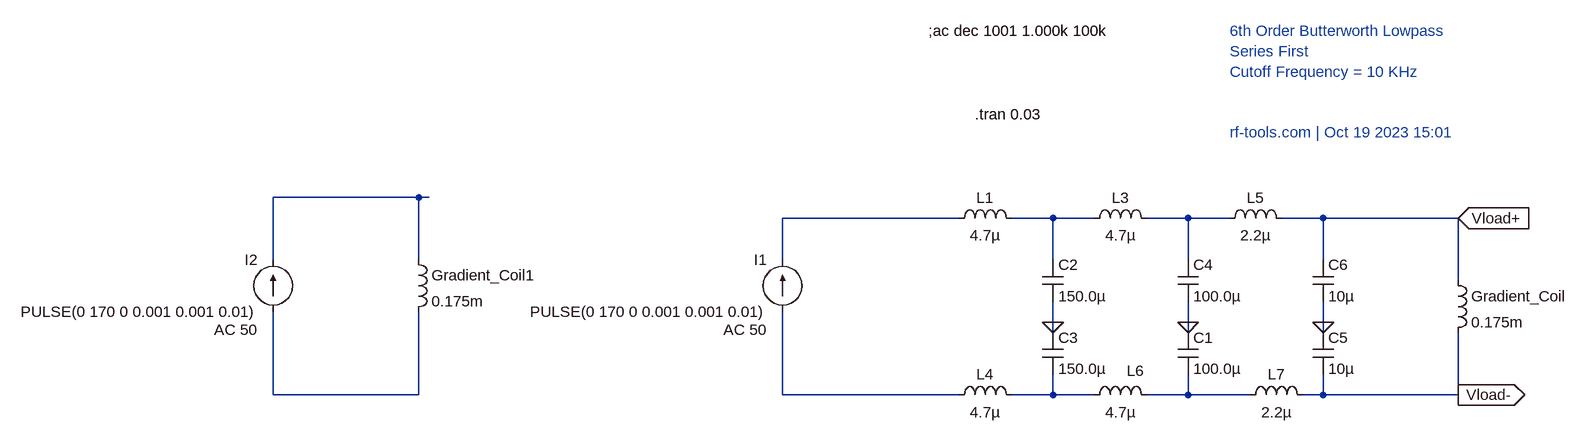
[diagram p0: schematic FinalV1.asc]
FinalV1.asc, the LTspice schematic file:
Version 4
SHEET 1 1200 400
WIRE -768 -32 -992 -32
WIRE -752 -32 -768 -32
WIRE 64 0 -208 0
WIRE 208 0 144 0
WIRE 272 0 208 0
WIRE 416 0 352 0
WIRE 480 0 416 0
WIRE 624 0 560 0
WIRE 832 0 624 0
WIRE -992 64 -992 -32
WIRE -768 64 -768 -32
WIRE -208 64 -208 0
WIRE 208 64 208 0
WIRE 416 64 416 0
WIRE 624 64 624 0
WIRE 832 96 832 0
WIRE 208 160 208 128
WIRE 416 160 416 128
WIRE 624 160 624 128
WIRE 208 176 208 160
WIRE 416 176 416 160
WIRE 624 176 624 160
WIRE -992 272 -992 144
WIRE -768 272 -768 144
WIRE -768 272 -992 272
WIRE -208 272 -208 144
WIRE 64 272 -208 272
WIRE 208 272 208 240
WIRE 208 272 144 272
WIRE 272 272 208 272
WIRE 416 272 416 240
WIRE 416 272 352 272
WIRE 512 272 416 272
WIRE 624 272 624 240
WIRE 624 272 592 272
WIRE 832 272 832 176
WIRE 832 272 624 272
FLAG 208 160 0
FLAG 416 160 0
FLAG 624 160 0
FLAG 832 0 Vload+
IOPIN 832 0 In
FLAG 832 272 Vload-
IOPIN 832 272 Out
SYMBOL ind 48 16 R270
WINDOW 0 32 56 VTop 2
WINDOW 3 5 56 VBottom 2
SYMATTR InstName L1
SYMATTR Value 4.7µ
SYMBOL cap 192 64 R0
SYMATTR InstName C2
SYMATTR Value 150.0µ
SYMBOL ind 256 16 R270
WINDOW 0 32 56 VTop 2
WINDOW 3 5 56 VBottom 2
SYMATTR InstName L3
SYMATTR Value 4.7µ
SYMBOL cap 400 64 R0
SYMATTR InstName C4
SYMATTR Value 100.0µ
SYMBOL ind 464 16 R270
WINDOW 0 32 56 VTop 2
WINDOW 3 5 56 VBottom 2
SYMATTR InstName L5
SYMATTR Value 2.2µ
SYMBOL cap 608 64 R0
SYMATTR InstName C6
SYMATTR Value 10µ
SYMBOL cap 400 176 R0
SYMATTR InstName C1
SYMATTR Value 100.0µ
SYMBOL cap 192 176 R0
SYMATTR InstName C3
SYMATTR Value 150.0µ
SYMBOL cap 608 176 R0
SYMATTR InstName C5
SYMATTR Value 10µ
SYMBOL ind 816 80 R0
SYMATTR InstName Gradient_Coil
SYMATTR Value 0.175m
SYMATTR SpiceLine Rser=0.194
SYMBOL ind 48 288 R270
WINDOW 0 32 56 VTop 2
WINDOW 3 5 56 VBottom 2
SYMATTR InstName L4
SYMATTR Value 4.7µ
SYMBOL ind 256 288 R270
WINDOW 0 38 79 VTop 2
WINDOW 3 5 56 VBottom 2
SYMATTR InstName L6
SYMATTR Value 4.7µ
SYMBOL ind 496 288 R270
WINDOW 0 32 56 VTop 2
WINDOW 3 5 56 VBottom 2
SYMATTR InstName L7
SYMATTR Value 2.2µ
SYMBOL current -208 144 R180
WINDOW 0 24 80 Left 2
WINDOW 3 24 0 Left 2
WINDOW 123 24 -28 Left 2
WINDOW 39 0 0 Left 0
SYMATTR InstName I1
SYMATTR Value PULSE(0 170 0 0.001 0.001 0.01)
SYMATTR Value2 AC 50
SYMBOL current -992 144 R180
WINDOW 0 24 80 Left 2
WINDOW 3 24 0 Left 2
WINDOW 123 24 -28 Left 2
WINDOW 39 0 0 Left 0
SYMATTR InstName I2
SYMATTR Value PULSE(0 170 0 0.001 0.001 0.01)
SYMATTR Value2 AC 50
SYMBOL ind -784 48 R0
SYMATTR InstName Gradient_Coil1
SYMATTR Value 0.175m
SYMATTR SpiceLine Rser=0.194
TEXT 16 -288 Left 2 !;ac dec 1001 1.000k 100k
TEXT 480 -288 Left 2 ;6th Order Butterworth Lowpass\nSeries First\nCutoff Frequency = 10 KHz\n\n\nrf-tools.com | Oct 19 2023 15:01
TEXT 88 -160 Left 2 !.tran 0.03

The netlist it stands for:
* FinalV1.asc
L1 N002 N003 4.7µ
C2 N003 0 150.0µ
L3 N003 N004 4.7µ
C4 N004 0 100.0µ
L5 N004 Vload+ 2.2µ
C6 Vload+ 0 10µ
C1 0 N008 100.0µ
C3 0 N007 150.0µ
C5 0 Vload- 10µ
L§Gradient_Coil Vload+ Vload- 0.175m Rser=0.194
L4 N006 N007 4.7µ
L6 N007 N008 4.7µ
L7 N008 Vload- 2.2µ
I1 N006 N002 PULSE(0 170 0 0.001 0.001 0.01) AC 50
I2 N005 N001 PULSE(0 170 0 0.001 0.001 0.01) AC 50
L§Gradient_Coil1 N001 N005 0.175m Rser=0.194
;ac dec 1001 1.000k 100k
* 6th Order Butterworth Lowpass
* Series First
* Cutoff Frequency = 10 KHz
* rf-tools.com | Oct 19 2023 15:01
.tran 0.03
.backanno
.end